# EAGLE schematic Schematics (EAGLE 6.4)
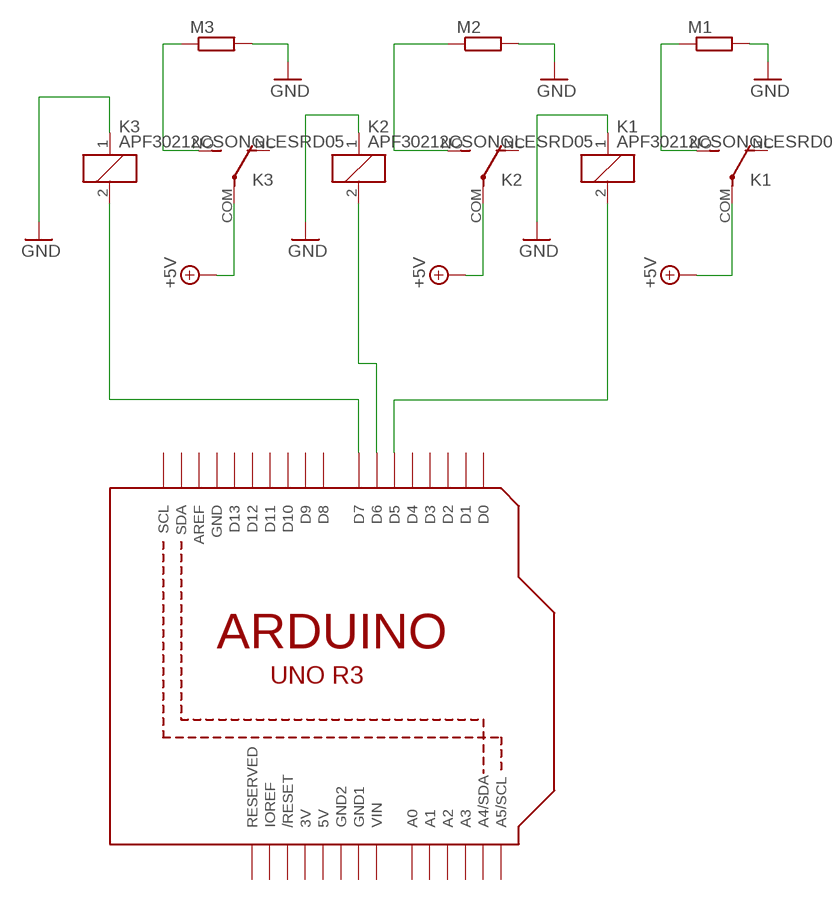
[diagram p0: schematic, sheet 1]

## Parts
K1  APF30212CSONGLESRD05  [SONGLESRD05]
K2  APF30212CSONGLESRD05  [SONGLESRD05]
K3  APF30212CSONGLESRD05  [SONGLESRD05]
M1  R-EU_0207/10  [0207/10]
M2  R-EU_0207/10  [0207/10]
M3  R-EU_0207/10  [0207/10]
U1  ARDUINOR3-BPLACE  [ARDUINOR3-BPLACE]

## Nets
+5V: K1.COM(2:P) K2.COM(2:P) K3.COM(2:P)
GND: K1.1 K2.1 K3.1 M1.2 M2.2 M3.2
N$1: K1.NO(2:S) M1.1
N$2: K2.NO(2:S) M2.1
N$3: K3.NO(2:S) M3.1
N$4: K1.2 U1.D5
N$5: K2.2 U1.D6
N$6: K3.2 U1.D7
Unconnected: K1.NC(2:O) K2.NC(2:O) K3.NC(2:O) U1.A0 U1.A1 U1.A2 U1.A3 U1.A4(A4/SDA) U1.A5(A5/SCL) U1.AREF U1.D0 U1.D1 U1.D2 U1.D3 U1.D4 U1.D8 U1.D9 U1.D10 U1.D11 U1.D12 U1.D13 U1.IOREF U1.RESERVED U1.RESET(/RESET) U1.SCL U1.SDA

## Power pins joined to a net without a drawn wire
3V: U1.3V
5V: U1.5V
GND: U1.GND
GND1: U1.GND1
GND2: U1.GND2
VIN: U1.VIN

## Library data of the parts
K1-K3 = SongleSRD05:APF30212C: Source: Data sheet <http://www.mycomkits.com/reference/Songle_SRD%28T73%29_Relay.pdf>; OC_FARNELL: unknown
M1-M3 = rcl:R-EU_: RESISTOR, European symbol
U1 = adafruit:ARDUINOR3: This is a new object for the new Arduino R3 - with extra pins that you may want to use (such as IOref, and duplicated A4/A5